# Altium schematic sheet DIgitalInputs.SchDoc: Title
size A4; SchTemplateVer: V2.0; Author: Adam Mizerkiewicz; CompanyName: Adam Mizerkiewicz; DrawnBy: Adam Mizerkiewicz; Engineer: Adam Mizerkiewicz; Organization: Adam Mizerkiewicz; Address1: Sarnia 2/19; Address2: 61-058 Poznań; Revision: 0.0; SheetNumber: 7; SheetTotal: 17
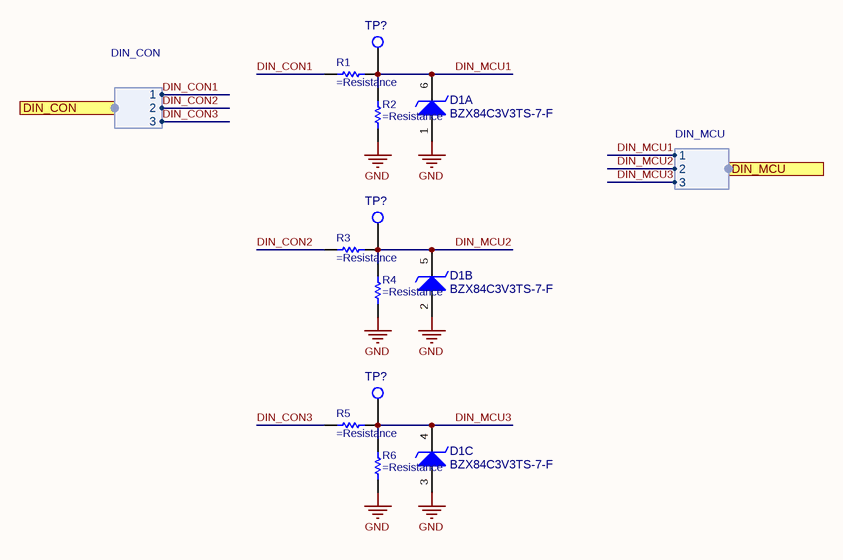
[diagram p0: DIgitalInputs.SchDoc]

## Parts
(Parts that share a designator on the sheet are numbered #1, #2 ... from top to bottom, then left to right.)
D1  BZX84C3V3TS-7-F  [SOT-363]  (parts A,B,C of 3)
R1  (no value)  [R0402]
R2  (no value)  [R0402]
R3  (no value)  [R0402]
R4  (no value)  [R0402]
R5  (no value)  [R0402]
R6  (no value)  [R0402]
TP?#1  TP_SMT  [TP_SMT]  (value not drawn)  (no BOM)
TP?#2  TP_SMT  [TP_SMT]  (value not drawn)  (no BOM)
TP?#3  TP_SMT  [TP_SMT]  (value not drawn)  (no BOM)

## Ports
DIN_CON (harness DIN_CON), DIN_MCU (harness DIN_MCU)

## Harnesses
DIN_MCU: 1, 2, 3
DIN_CON: 1, 2, 3

## Nets
GND: D1.1(A1) D1.2(A2) D1.3(A3) R2.1 R4.1 R6.1
DIN_CON1: R1.1 ; port DIN_CON.1
DIN_CON2: R3.1 ; port DIN_CON.2
DIN_CON3: R5.1 ; port DIN_CON.3
DIN_MCU1: D1.6(C1) R1.2 R2.2 TP?#1.1 ; port DIN_MCU.1
DIN_MCU2: D1.5(C2) R3.2 R4.2 TP?#2.1 ; port DIN_MCU.2
DIN_MCU3: D1.4(C3) R5.2 R6.2 TP?#3.1 ; port DIN_MCU.3

## Notes on the sheet
- Revision
  =Revision
- Sheet
  =SheetNumber / =SheetTotal

## Library data of the parts
D1 = BZX84C3V3TS-7-F: DIODE ZENER ARRAY 3.3V SOT-363; Manufacturer: Diodes Inc.; ESD Protection: No; Forward Voltage: 900mV; Impedance: 95Ω; Max Power Dissipation: 200mW; Max Reverse Leakage Current: 5µA; Number of Elements: 3; Polarity: Unidirectional; Reverse Standoff Voltage: 1V; Test Current: 5mA; Tolerance: 6%; Voltage Tolerance: 6.06%; Supplier 1: DigiKey; Supplier Part Number 1: 31-BZX84C3V3TS-7-FCT-ND; Supplier: DigiKey; Supplier Part Number: 31-BZX84C3V3TS-7-FCT-ND; Manufacturer Part Number: BZX84C3V3TS-7-F; RoHS: Compliant; Category: Zener Diodes; Stock: 2827; Pricing: 1=0,31, 10=0,213, 100=0,099 (USD); Case/Package: SOT-363; China RoHS: Compliant; Contact Plating: Tin; Height: 1mm; Length: 2.2mm; Lifecycle Status: Production; Max Operating Temperature: 150°C; Min Operating Temperature: -65°C; Mounting Technology: Surface Mount; Pins: 6; Number of Terminals: 6; Packaging: Tape & Reel; Peak Reverse Current: 5µA; Power Dissipation: 200mW; Power Rating: 200mW; REACH SVHC: Yes; Reference Voltage: 3.3V; Weight: 6.010099mg; Width: 2.2mm; Zener Current: 5mA; Zener Voltage: 3.3V; ComponentLink1URL: https://datasheet.octopart.com:443/BZX84C3V3TS-7-F-Diodes-Inc.-datasheet-160640132.pdf?src-supplier=IHS; ComponentLink1Description: https://datasheet.octopart.com:443/BZX84C3V3TS-7-F-Diodes-Inc.-datasheet-160640132.pdf?src-supplier=IHS; ComponentLink2URL: https://datasheet.octopart.com:443/BZX84C3V3TS-7-F-Diodes-Inc.-datasheet-11551317.pdf?src-supplier=Diodes+Inc+SCT; ComponentLink2Description: https://datasheet.octopart.com:443/BZX84C3V3TS-7-F-Diodes-Inc.-datasheet-11551317.pdf?src-supplier=Diodes+Inc+SCT; ComponentLink3URL: https://sigma.octopart.com:443/138865995/technical_drawing/Diodes-Inc.-BZX84C3V3TS-7-F.pdf?src-supplier=Diodes+Inc+SCT; ComponentLink3Description: https://sigma.octopart.com:443/138865995/technical_drawing/Diodes-Inc.-BZX84C3V3TS-7-F.pdf?src-supplier=Diodes+Inc+SCT; ComponentLink4URL: http://sigma.octopart.com:80/15616913/materials_sheet/Diodes-Inc.-BZX84C3V3TS-7-F.pdf?src-supplier=Compliance+Statements; ComponentLink4Description: http://sigma.octopart.com:80/15616913/materials_sheet/Diodes-Inc.-BZX84C3V3TS-7-F.pdf?src-supplier=Compliance+Statements
R1-R6 = RES0402-30k-1%: 0402 30K Ohms 1% High Power Thick Film Surface Mount Chip Resistor; Manufacturer: Vishay; Manufacturer Part Number: CRCW040230K0FKEDHP; Manufacturer Package Identifier: CRCW0402-HPe3; Resistance: 30kΩ; Max Power Dissipation: 125mW; Power Dissipation: 200mW; Value: 30kΩ; Temperature Coefficient: 100ppm/°C; Voltage Rating: 50V; Supplier 1: DigiKey; Supplier Part Number 1: CRCW040230K0FKEDHPCT-ND; Supplier: DigiKey; Supplier Part Number: CRCW040230K0FKEDHPCT-ND; RoHS: Compliant; Category: Chip SMD Resistors; Stock: 9449; Pricing: 1=0,13, 10=0,061, 25=0,0472, 50=0,0392, 100=0,0331, 250=0,027, 500=0,0235, 1000=0,02072, 5000=0,01631 (USD); Case/Package: 0402; Case Code (Imperial): 0402; Case Code (Metric): 1005; China RoHS: Non-Compliant; Composition: Thick Film; Contact Plating: Tin; Features: Automotive AEC-Q200; Height: 300µm; Lead Free: Lead Free; Length: 990.6µm; Lifecycle Status: Production; Max Operating Temperature: 155°C; Min Operating Temperature: -55°C; Mounting Technology: Surface Mount; Number of Terminals: 2; Number of Terminations: 2; Packaging: Digi-Reel®; Power Rating: 200mW; Radiation Hardening: No; REACH SVHC: Yes; Tolerance: 1%; Width: 500µm; Working Voltage: 50V; ComponentLink1URL: https://datasheet.octopart.com/CRCW040230K0FKEDHP-Vishay-datasheet-83567917.pdf; ComponentLink1Description: https://datasheet.octopart.com/CRCW040230K0FKEDHP-Vishay-datasheet-83567917.pdf; ComponentLink2URL: https://datasheet.octopart.com/D-CRCW-e3-Standard-Thick-Film-Chip-Resistors-Vishay-datasheet-family-64.pdf; ComponentLink2Description: https://datasheet.octopart.com/D-CRCW-e3-Standard-Thick-Film-Chip-Resistors-Vishay-datasheet-family-64.pdf; ComponentLink3URL: https://datasheet.octopart.com:443/CRCW040230K0FKEDHP-Vishay-datasheet-137113427.pdf?src-supplier=X-ON; ComponentLink3Description: https://datasheet.octopart.com:443/CRCW040230K0FKEDHP-Vishay-datasheet-137113427.pdf?src-supplier=X-ON; ComponentLink4URL: https://datasheet.octopart.com:443/CRCW040230K0FKEDHP-Vishay-datasheet-62316122.pdf?src-supplier=Future+Electronics; ComponentLink4Description: https://datasheet.octopart.com:443/CRCW040230K0FKEDHP-Vishay-datasheet-62316122.pdf?src-supplier=Future+Electronics; ComponentLink5URL: http://sigma.octopart.com:80/rohs_certificate/D-CRCW-e3-Standard-Thick-Film-Chip-Resistors-Vishay-family-102.pdf?src-supplier=Compliance+Statements; ComponentLink5Description: http://sigma.octopart.com:80/rohs_certificate/D-CRCW-e3-Standard-Thick-Film-Chip-Resistors-Vishay-family-102.pdf?src-supplier=Compliance+Statements
TP?#1-TP?#3 = TP: TEST POINT